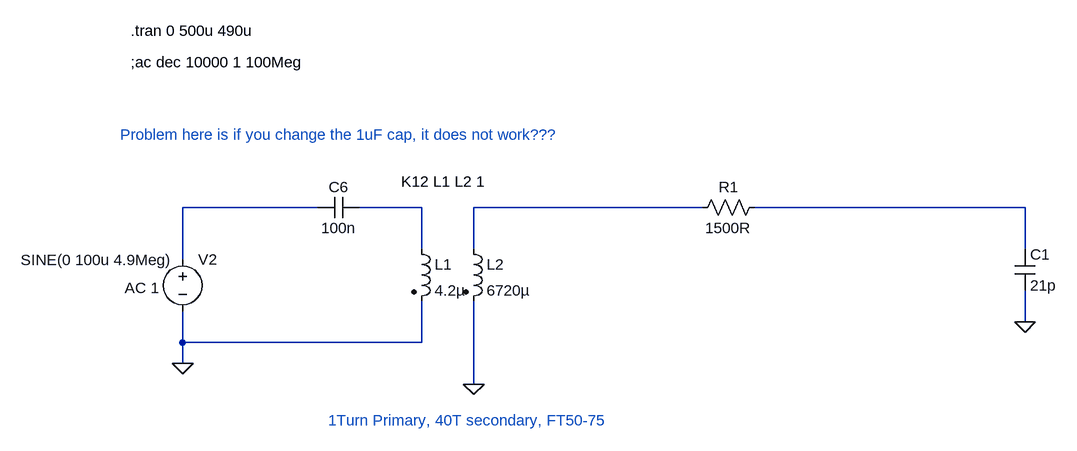
[diagram p0: schematic IF Detector Test.asc]
IF Detector Test.asc, the LTspice schematic file:
Version 4
SHEET 1 3500 708
WIRE 1424 80 1216 80
WIRE 1584 80 1488 80
WIRE 2016 80 1664 80
WIRE 2512 80 2096 80
WIRE 1584 144 1584 80
WIRE 1664 144 1664 80
WIRE 2512 144 2512 80
WIRE 1216 160 1216 80
WIRE 2512 256 2512 208
WIRE 1216 288 1216 240
WIRE 1584 288 1584 224
WIRE 1584 288 1216 288
WIRE 1216 320 1216 288
WIRE 1664 352 1664 224
FLAG 1216 320 0
FLAG 1664 352 0
FLAG 2512 256 0
SYMBOL voltage 1216 144 R0
WINDOW 123 -89 60 Left 2
WINDOW 39 0 0 Left 2
WINDOW 3 -249 17 Left 2
SYMATTR Value2 AC 1
SYMATTR Value SINE(0 100u 4.9Meg)
SYMATTR InstName V2
SYMBOL ind2 1568 128 R0
SYMATTR InstName L1
SYMATTR Value 4.2µ
SYMATTR Type ind
SYMBOL ind2 1648 128 R0
SYMATTR InstName L2
SYMATTR Value 6720µ
SYMATTR Type ind
SYMBOL cap 1488 64 R90
WINDOW 0 0 32 VBottom 2
WINDOW 3 32 32 VTop 2
SYMATTR InstName C6
SYMATTR Value 100n
SYMBOL res 2112 64 R90
WINDOW 0 0 56 VBottom 2
WINDOW 3 32 56 VTop 2
SYMATTR InstName R1
SYMATTR Value 1500R
SYMBOL cap 2496 144 R0
SYMATTR InstName C1
SYMATTR Value 21p
TEXT 1136 -192 Left 2 !.tran 0 500u 490u
TEXT 1136 -144 Left 2 !;ac dec 10000 1 100Meg
TEXT 1552 40 Left 2 !K12 L1 L2 1
TEXT 1440 408 Left 2 ;1Turn Primary, 40T secondary, FT50-75
TEXT 1120 -32 Left 2 ;Problem here is if you change the 1uF cap, it does not work???

The netlist it stands for:
* IF Detector Test.asc
V2 N001 0 SINE(0 100u 4.9Meg) AC 1
L1 N002 0 4.2µ
L2 N003 0 6720µ
C6 N002 N001 100n
R1 N004 N003 1500R
C1 N004 0 21p
.tran 0 500u 490u
;ac dec 10000 1 100Meg
K12 L1 L2 1
* 1Turn Primary, 40T secondary, FT50-75
* Problem here is if you change the 1uF cap, it does not work???
.backanno
.end